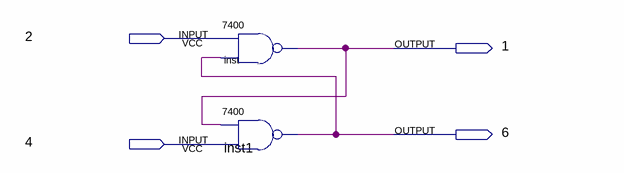
[diagram p0: schematic sheet]
// Quartus schematic exp3.bdf as structural Verilog: 2 symbols, 4 pins
module exp3 (
  input  \2 ,
  input  \4 ,
  output \1 ,
  output \6 
);

  \7400  inst (.\3 (\6 ), .\2 (\2 ), .\1 (\1 ));
  \7400  inst1 (.\3 (\4 ), .\2 (\1 ), .\1 (\6 ));
endmodule
